# EasyEDA Pro project ProPrj_超级电容V1.1-正式版.epro, board PCB1
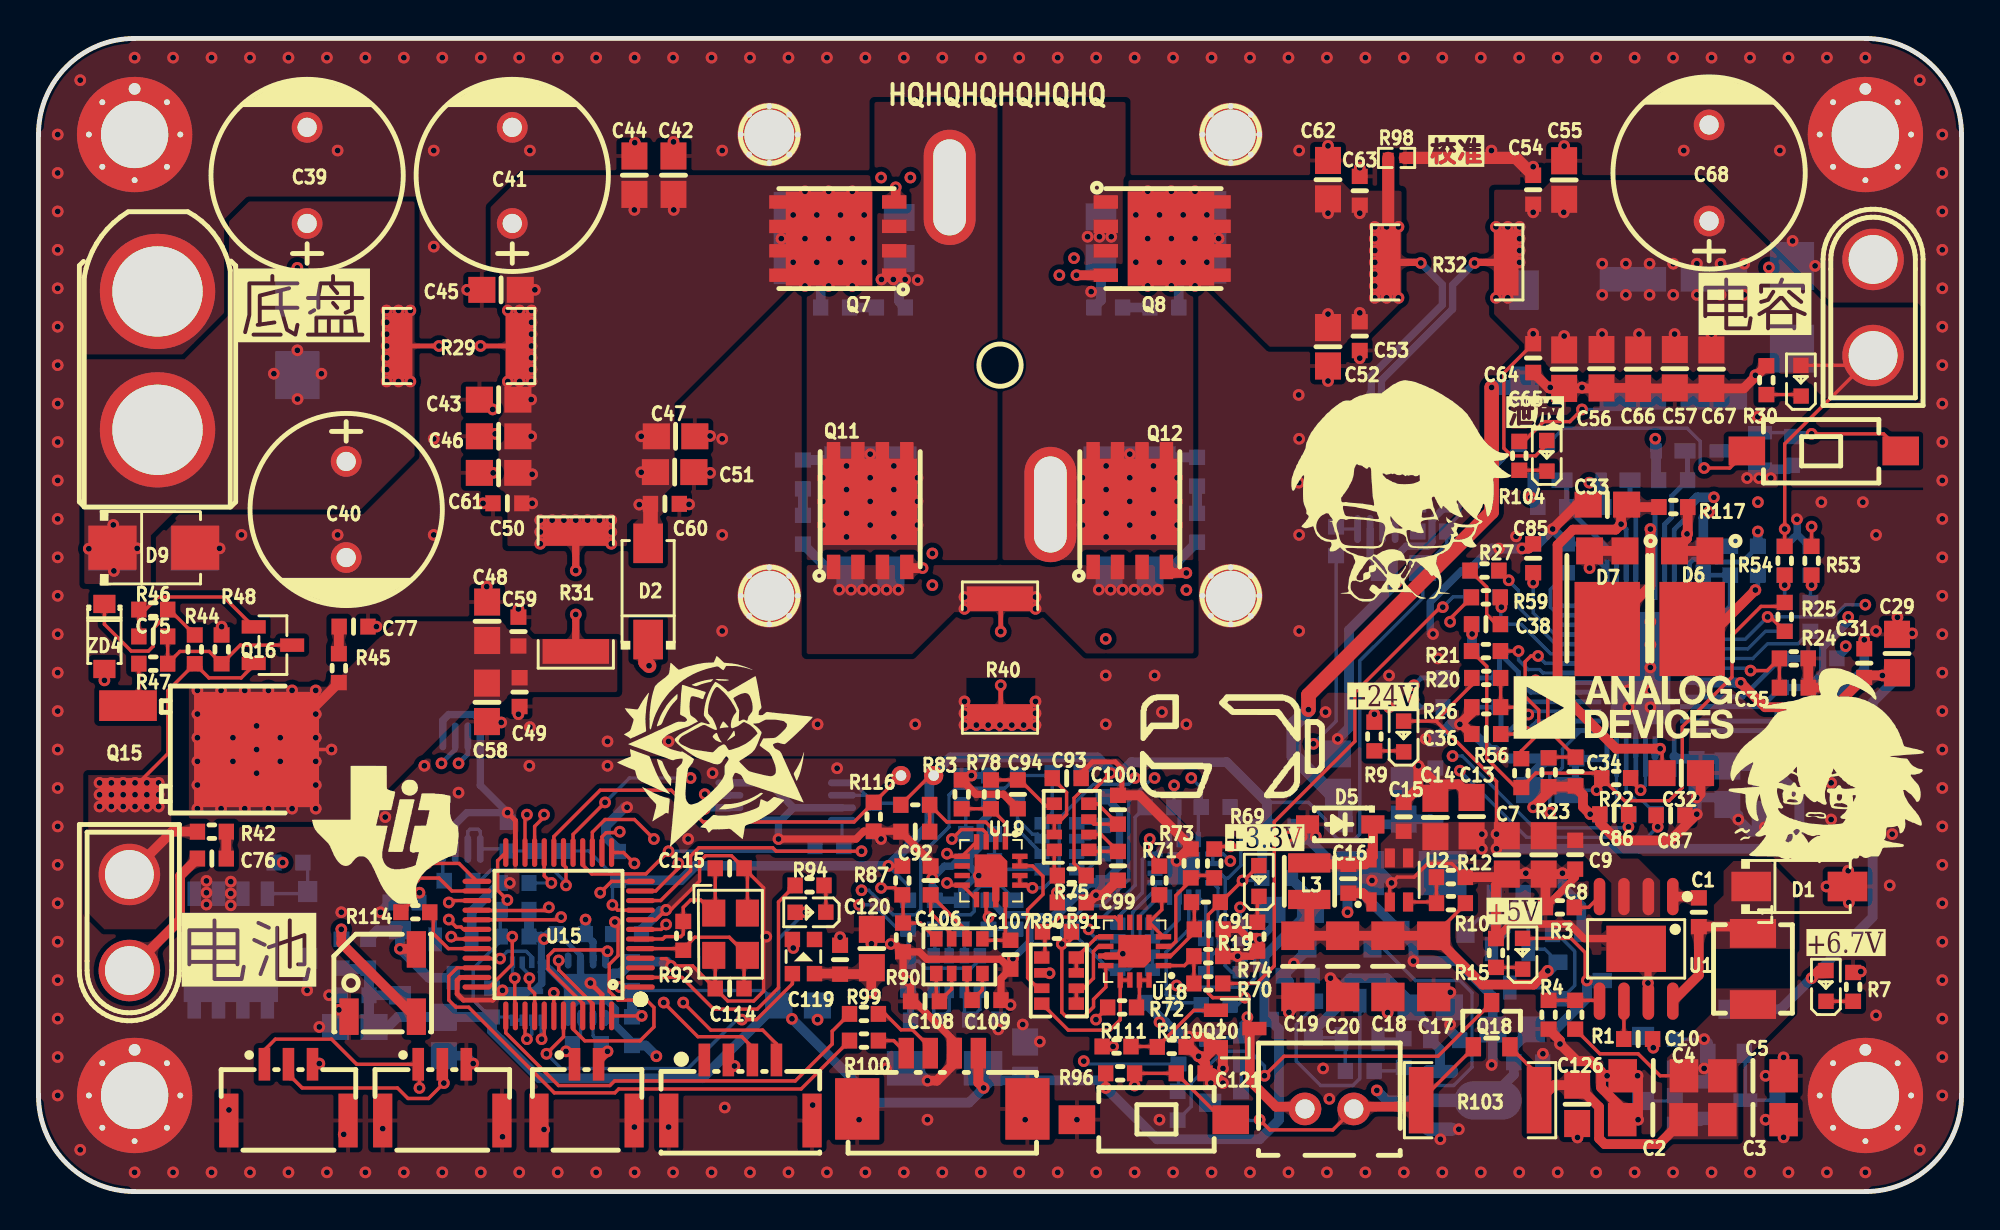
[diagram p8: board, top side]
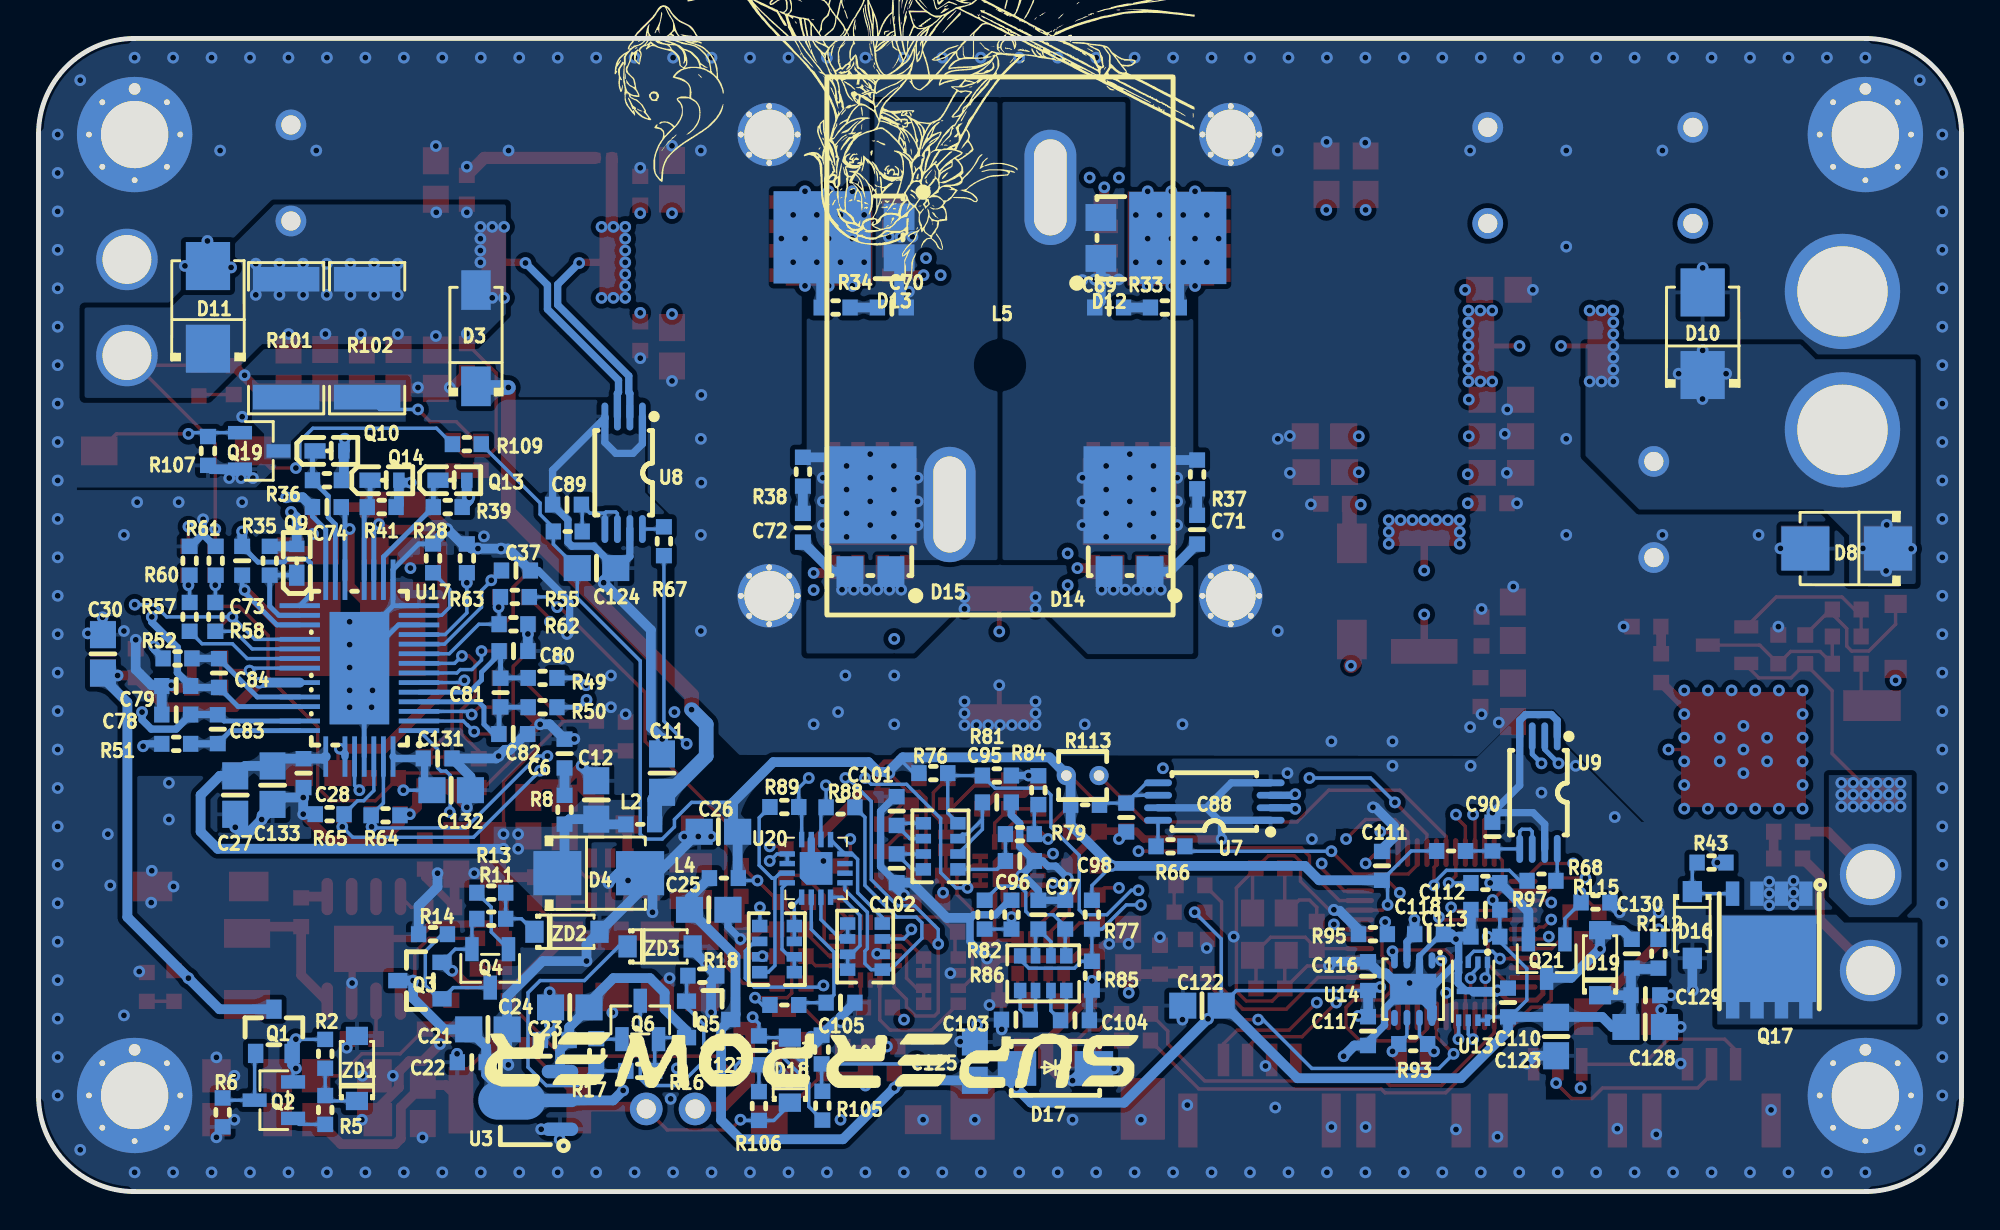
[diagram p9: board, bottom side, seen from below]

Outline 100 x 60 mm; copper layers: Top Layer, 信号, 电源, Bottom Layer. Coordinates in mm from the lower left corner of the outline.
Outline path: 0,55 0,5 arc(1.46,1.46) 5,0 95,0 arc(98.54,1.46) 100,5 100,55 arc(98.54,58.54) 95,60 5,60 arc(1.46,58.54) 0,55
Stack: Top Layer 0.035mm 外层铜厚1oz / Dielectric1 0.2104mm 7628 RC49% 8.6mil / 信号 0.0152mm 内层铜厚 / Dielectric2 1.065mm 1.1mm H/HOZ 含铜 / 电源 0.0152mm 内层铜厚 / Dielectric3 0.2104mm 7628 RC49% 8.6mil / Bottom Layer 0.035mm 外层铜厚1oz

## Design rules (mm)
net CSP: DP4
net CSN: DP4
net CAN-: DP5
net CAN+: DP5
net OSCOUT: DP6
net OSCIN: DP6
template: 自定义配置
spacing copperThickness1oz (default): track to track 0.152, other pairs 0 to 0.3
spacing copperThickness2oz: track to track 0.203, other pairs 0.152 to 0.3
track width copperThickness1oz (default): min 0.127, default 0.254, max 2.54
track width copperThickness2oz: min 0.203, default 0.254, max 2.54
differential pair differentialPair (default): width min 0.127, default 0.254, max 2.54; gap min 0.152, default 0.152
via viaSize (default): diameter min 0.5, default 0.61, max 10; hole min 0.3, default 0.305, max 6.299
net AGND uses 大电流
net CELL uses 大电流
net CAP uses 大电流
net CS+ uses 大电流
net SW2 uses 大电流
net SW1 uses 大电流
net VIN uses 大电流
net CHASSIS uses 大电流
net CSOUT+ uses 大电流
pour e2638 uses 多层直连
pour e18530 uses 多层直连

## Placement (name value [footprint] x y rotation side)
BUZZER1  SMD-5025-0340-12Ω  [BUZ-SMD_3P-L5.0-W5.0-BL]  17.9 10.85 90 top
C1  100nF  [0603电容-简化]  86.34 14.53 270 top
C2  47uF  [1206电容-简化]  83.95 3.74 180 top
C3  47uF  [1206电容-简化]  89.15 3.74 0 top
C4  47uF  [1206电容-简化]  83.97 6.03 180 top
C5  47uF  [1206电容-简化]  89.15 6.03 0 top
C6  100nF  [0603电容-简化]  72.64 22.79 90 bottom
C7  10uF  [0805电容-简化]  76.35 17.52 90 top
C8  10uF  [0805电容-简化]  78.27 17.52 90 top
C9  100nF  [0603电容-简化]  79.91 17.53 90 top
C10  10nF  [0603电容-简化]  83.19 7.94 0 top
C11  10uF  [0805电容-简化]  67.57 21.77 270 bottom
C12  10uF  [0805电容-简化]  70.99 20.38 270 bottom
C13  10uF  [0805电容-简化]  74.52 19.51 270 top
C14  10uF  [0805电容-简化]  72.64 19.46 270 top
C15  100nF  [0603电容-简化]  70.99 19.5 270 top
C16  100nF  [0603电容-简化]  68.11 16.28 90 top
C17  47uF  [1206电容-简化]  72.55 11.72 270 top
C18  47uF  [1206电容-简化]  70.17 11.72 270 top
C19  47uF  [1206电容-简化]  65.49 11.72 270 top
C20  47uF  [1206电容-简化]  67.82 11.72 270 top
C21  10uF  [0805电容-简化]  76.63 8.44 180 bottom
C22  100nF  [0603电容-简化]  77.47 6.73 180 bottom
C23  100nF  [0603电容-简化]  73.15 7.88 0 bottom
C24  10uF  [0805电容-简化]  72.37 9.58 180 bottom
C25  10uF  [0805电容-简化]  65.15 14.66 180 bottom
C26  10uF  [0805电容-简化]  64.64 18.72 180 bottom
C27  10uF  [0805电容-简化]  89.77 20.63 90 bottom
C28  100nF  [0603电容-简化]  86.22 21.77 270 bottom
C29  10uF  [0805电容-简化]  96.65 28 270 top
C30  10uF  [0805电容-简化]  96.65 27.98 270 bottom
C31  100nF  [0603电容-简化]  94.94 27.5 90 top
C32  10uF  [0805电容-简化]  85.43 21.77 0 top
C33  10uF  [0805电容-简化]  81.58 35.74 0 top
C34  10nF  [0603电容-简化]  79.93 21.86 90 top
C35  10nF  [0603电容-简化]  91.28 26.22 180 top
C36  1uF  [0603电容-简化]  75.28 23.81 0 top
C37  220pF  [0603电容-简化]  75.17 32.31 0 bottom
C38  10nF  [0603电容-简化]  75.27 29.52 0 top
C39  220uF  [CAP-TH_BD10.0-P5.00-D0.6-FD]  13.97 52.87 90 top
C40  220uF  [CAP-TH_BD10.0-P5.00-D0.6-FD]  16 35.49 270 top
C41  220uF  [CAP-TH_BD10.0-P5.00-D0.6-FD]  24.64 52.87 90 top
C42  10uF  [0805电容-简化]  33.02 52.88 270 top
C43  10uF  [0805电容-简化]  23.93 41.2 0 top
C44  10uF  [0805电容-简化]  30.99 52.88 270 top
C45  10uF  [0805电容-简化]  24.06 46.92 0 top
C46  10uF  [0805电容-简化]  23.93 39.3 0 top
C47  10uF  [0805电容-简化]  33.13 39.3 0 top
C48  10uF  [0805电容-简化]  23.33 29.67 90 top
C49  100nF  [0603电容-简化]  25.02 25.99 270 top
C50  100nF  [0603电容-简化]  24.38 35.81 180 top
C51  10uF  [0805电容-简化]  33.08 37.44 0 top
C52  10uF  [0805电容-简化]  67.06 43.96 270 top
C53  100nF  [0603电容-简化]  68.71 44.51 270 top
C54  100nF  [0603电容-简化]  77.72 52.13 90 top
C55  10uF  [0805电容-简化]  79.34 52.63 90 top
C56  10uF  [0805电容-简化]  81.28 42.81 270 top
C57  10uF  [0805电容-简化]  85.09 42.81 270 top
C58  10uF  [0805电容-简化]  23.32 25.46 90 top
C59  100nF  [0603电容-简化]  24.96 29.14 270 top
C60  100nF  [0603电容-简化]  32.57 35.78 180 top
C61  10uF  [0805电容-简化]  23.93 37.39 0 top
C62  10uF  [0805电容-简化]  67.06 52.65 270 top
C63  100nF  [0603电容-简化]  68.71 52.07 270 top
C64  100nF  [0603电容-简化]  77.72 43.37 90 top
C65  10uF  [0805电容-简化]  79.34 42.79 90 top
C66  10uF  [0805电容-简化]  83.19 42.79 90 top
C67  10uF  [0805电容-简化]  87 42.79 90 top
C68  220uF  [CAP-TH_BD10.0-P5.00-D0.6-FD]  86.87 53 90 top
C69  4.7nF  [0603电容-简化]  44.32 46 180 bottom
C70  4.7nF  [0603电容-简化]  55.63 46 0 bottom
C71  4.7nF  [0603电容-简化]  39.75 34.44 90 bottom
C72  4.7nF  [0603电容-简化]  60.25 34.54 90 bottom
C73  1uF  [0603电容-简化]  89.41 32.82 270 bottom
C74  1uF  [0603电容-简化]  85 35.62 180 bottom
C75  100nF  [0603电容-简化]  5.97 28.89 180 top
C76  10nF  [0603电容-简化]  9.02 17.33 180 top
C77  10nF  [0603电容-简化]  16.38 29.4 0 top
C78  100nF  [0603电容-简化]  92.84 24.82 180 bottom
C79  100nF  [0603电容-简化]  92.84 26.31 0 bottom
C80  10nF  [0603电容-简化]  75.3 28.12 180 bottom
C81  10nF  [0603电容-简化]  75.97 25.96 90 bottom
C82  10nF  [0603电容-简化]  75.31 23.81 0 bottom
C83  470nF  [0603电容-简化]  90.68 24.06 270 bottom
C84  470nF  [0603电容-简化]  90.61 26.98 270 bottom
C85  47nF  [0603电容-简化]  77.72 32.95 270 top
C86  47nF  [0603电容-简化]  81.94 19.64 0 top
C87  47nF  [0603电容-简化]  84.87 19.58 180 top
C88  100nF  [0603电容-简化]  43.43 19.46 270 bottom
C89  100nF  [0603电容-简化]  72.52 35.74 0 bottom
C90  100nF  [0603电容-简化]  24.4 18.47 90 bottom
C91  100nF  [0603电容-简化]  60.86 13.64 0 top
C92  100nF  [0603电容-简化]  45.59 18.72 180 top
C93  10nF  [0603电容-简化]  53.47 21.51 0 top
C94  10nF  [0603电容-简化]  50.93 20.67 90 top
C95  10nF  [0603电容-简化]  50.16 20.25 180 bottom
C96  10nF  [0603电容-简化]  48.97 17.2 0 bottom
C97  10nF  [0603电容-简化]  48.01 14.41 90 bottom
C98  10nF  [0603电容-简化]  46.61 14.41 270 bottom
C99  10nF  [0603电容-简化]  56.13 16.95 90 top
C100  10nF  [0603电容-简化]  56.13 19.87 270 top
C101  10nF  [0603电容-简化]  55.37 19.8 270 bottom
C102  10nF  [0603电容-简化]  55.37 16.82 90 bottom
C103  10nF  [0603电容-简化]  49.17 8.95 180 bottom
C104  10nF  [0603电容-简化]  46.1 8.91 0 bottom
C105  100nF  [0603电容-简化]  58.29 9.83 180 bottom
C106  10nF  [0603电容-简化]  46.39 16.19 90 top
C107  10nF  [0603电容-简化]  50.55 12.33 90 top
C108  10nF  [0603电容-简化]  46.1 9.9 0 top
C109  10nF  [0603电容-简化]  49.3 9.96 180 top
C110  100nF  [0603电容-简化]  23.58 9.84 270 bottom
C111  100nF  [0603电容-简化]  30.14 16.95 270 bottom
C112  100nF  [0603电容-简化]  24.76 14.66 180 bottom
C113  100nF  [0603电容-简化]  24.76 13.26 180 bottom
C114  20pF  [0603电容-简化]  35.94 10.57 180 top
C115  20pF  [0603电容-简化]  35.94 16.82 0 top
C116  100nF  [0603电容-简化]  30.86 11.21 270 bottom
C117  100nF  [0603电容-简化]  30.86 8.35 90 bottom
C118  100nF  [0603电容-简化]  27.69 13.39 180 bottom
C119  100nF  [0603电容-简化]  41.68 12.07 90 top
C120  10uF  [0805电容-简化]  43.34 12.64 90 top
C121  100nF  [0603电容-简化]  59.91 6.15 0 top
C122  10uF  [0805电容-简化]  39.5 9.67 180 bottom
C123  10uF  [0805电容-简化]  21.08 8.07 90 bottom
C124  10uF  [0805电容-简化]  70.98 32.44 0 bottom
C125  10uF  [0805电容-简化]  51.31 6.79 270 bottom
C126  10uF  [0805电容-简化]  80.01 4.54 270 top
C127  10nF  [0603电容-简化]  62.54 7.35 90 bottom
C128  10uF  [0805电容-简化]  16.45 8.56 180 bottom
C129  100nF  [0603电容-简化]  16.44 10.22 0 bottom
C130  100nF  [0603电容-简化]  17.14 12.38 270 bottom
C131  100nF  [0603电容-简化]  79.24 22.53 180 bottom
C132  10uF  [0805电容-简化]  78.54 20.88 0 bottom
C133  10uF  [0805电容-简化]  87.83 21.14 90 bottom
CN1  XT60UPB-F  [CONN-TH_XT60UPB-F]  6.19 43.24 270 top
CN2  XT30U-M  [conn-th_xt30u-m]  95.4 46 90 top
CN3  XT30U-M  [conn-th_xt30u-m]  4.73 14 270 top
CN4  WAFER-GH1.25-4PWB  [CONN-SMD_4P-P1.25_XUNPU_WAFER-GH1.25-4PWB]  36.5 5.27 0 top
CN5  WAFER-GH1.25-2PLB  [conn-th_2p-p1.25_xunpu_wafer-gh1.25-2plb]  28.5 4.95 0 top
CN6  WAFER-GH1.25-3PLB  [conn-smd_3p-p1.25_xunpu_wafer-gh1.25-3plb]  21 4.95 0 top
CN7  WAFER-GH1.25-3PLB  [conn-smd_3p-p1.25_xunpu_wafer-gh1.25-3plb]  13 4.95 0 top
CN8  532610471  [CONN-SMD_4P-P1.25_53261-0471]  47 5.75 0 top
CN9  B2B-XH-A(LF)(SN)  [CONN-TH_B2B-XH-A-LF-SN]  67.13 4.3 0 top
D1  SS54  [SMA_L4.4-W2.8-LS5.4-R-RD]  91.57 15.87 0 top
D2  SS54  [SMA_L4.4-W2.8-LS5.4-R-RD]  31.7 31.23 90 top
D3  SS54  [SMA_L4.4-W2.8-LS5.4-R-RD]  77.25 44.4 90 bottom
D4  SMBJ33A-E3/52  [SMB_L4.3-W3.6-LS5.3-RD]  70.87 16.57 180 bottom
D5  B5819W SL  [SOD-123_L2.7-W1.6-LS3.7-RD-1]  67.69 19.11 180 top
D6  SBR10E45P5-13  [POWERDI-5_L5.4-W4.0-LS6.5-RD]  85.99 31.3 90 top
D7  SBR10E45P5-13  [POWERDI-5_L5.4-W4.0-LS6.5-RD]  81.58 31.3 90 top
D8  SMBJ33A-E3/52  [SMB_L4.3-W3.6-LS5.3-RD]  5.97 33.46 0 bottom
D9  SMBJ33A-E3/52  [SMB_L4.3-W3.6-LS5.3-RD]  6 33.5 0 top
D10  SMBJ33A-E3/52  [SMB_L4.3-W3.6-LS5.3-RD]  13.46 44.63 90 bottom
D11  SMBJ33A-E3/52  [SMB_L4.3-W3.6-LS5.3-RD]  91.19 46.01 90 bottom
D12  SS10P6-M3/86A  [TO-277A_L6.1-W4.6-P2.13-LS6.5-TR]  42.75 49.62 0 bottom
D13  SS10P6-M3/86A  [TO-277A_L6.1-W4.6-P2.13-LS6.5-TR]  57.25 49.65 180 bottom
D14  SS10P6-M3/86A  [TO-277A_L6.1-W4.6-P2.13-LS6.5-TR]  43.26 34.25 270 bottom
D15  SS10P6-M3/86A  [TO-277A_L6.1-W4.6-P2.13-LS6.5-TR]  56.74 34.25 270 bottom
D16  MMSZ5239B_R1_00001  [SOD-123F_L2.7-W1.6-LS3.8-RD-1]  14 13.87 270 bottom
D17  SMAJ5.0CA/TR13  [SMA_L4.4-W2.6-LS5.0-BI]  47.12 6.41 0 bottom
D18  1N4148W  [SOD-123_L2.8-W1.8-LS3.7-RD]  60.93 6.32 90 bottom
D19  1N4148W  [SOD-123_L2.8-W1.8-LS3.7-RD]  18.8 11.91 90 bottom
L1  22uH  [IND-SMD_L4.5-W4.1_SRP4020TA]  89.15 11.58 270 top
L2  10uH  [0603磁珠-简化]  68.71 19.11 0 bottom
L3  10uH  [IND-SMD_L2.5-W2.0_SWPA252012S]  66.08 16.15 270 top
L4  10uH  [0603磁珠-简化]  64.36 16.31 180 bottom
L5  -  [VER2923-332KL]  50 44 270 bottom
LED1  XL-1608SURC-06  [LED0603-RD_RED]  92.95 10.7 90 top
LED2  XL-1608SURC-06  [LED0603-RD_RED]  70.99 23.68 90 top
LED3  XL-1608SURC-06  [LED0603-RD_RED]  77.18 12.38 90 top
LED4  XL-1608SURC-06  [LED0603-RD_RED]  63.46 16.16 90 top
LED5  XL-1608SURC-06  [LED0603-RD_RED]  91.65 42.19 90 top
LED6  XL-1608SURC-06  [LED0603-RD_RED]  40.14 14.53 180 top
LED7  XL-1608SURC-06  [LED0603-RD_RED]  78.44 38.28 90 top
Q1  AO3401A  [SOT-23_L2.9-W1.3-P1.90-LS2.4-BR]  87.76 8.34 270 bottom
Q2  MMBT5401  [SOT-23-3_L2.9-W1.3-P1.90-LS2.4-BR]  87.76 4.75 180 bottom
Q3  AO3401A  [SOT-23_L2.9-W1.3-P1.90-LS2.4-BR]  80.16 10.98 180 bottom
Q4  MMBT5401  [SOT-23-3_L2.9-W1.3-P1.90-LS2.4-BR]  76.51 11.61 90 bottom
Q5  AO3401A  [SOT-23_L2.9-W1.3-P1.90-LS2.4-BR]  65.15 8.96 0 bottom
Q6  MMBT5401  [SOT-23-3_L2.9-W1.3-P1.90-LS2.4-BR]  68.71 8.93 270 bottom
Q7  CSD18540Q5B  [VSON-CLIP-8_L5.0-W6.0-P1.27-BL]  41.5 49.59 90 top
Q8  CSD18540Q5B  [VSON-CLIP-8_L5.0-W6.0-P1.27-BL]  58.5 49.59 270 top
Q9  CDBVRL140-HF  [LED-SMD_L1.6-W0.8-RD-2]  86.57 32.82 90 bottom
Q10  CDBVRL140-HF  [LED-SMD_L1.6-W0.8-RD-2]  84.87 38.54 180 bottom
Q11  CSD18540Q5B  [VSON-CLIP-8_L5.0-W6.0-P1.27-BL]  43.25 35.5 0 top
Q12  CSD18540Q5B  [VSON-CLIP-8_L5.0-W6.0-P1.27-BL]  56.75 35.5 0 top
Q13  CDBVRL140-HF  [LED-SMD_L1.6-W0.8-RD-2]  78.47 37.01 180 bottom
Q14  CDBVRL140-HF  [LED-SMD_L1.6-W0.8-RD-2]  82.01 37.01 180 bottom
Q15  AGM60P40D  [TO-252-3_L6.6-W6.1-P4.57-LS9.9-BR]  8 23 180 top
Q16  MMBT5401  [SOT-23-3_L2.9-W1.3-P1.90-LS2.4-BR]  12.19 28.43 180 top
Q17  CSD18540Q5B  [VSON-CLIP-8_L5.0-W6.0-P1.27-BL]  10 12.5 0 bottom
Q18  AO3401A  [SOT-23_L2.9-W1.3-P1.90-LS2.4-BR]  75.56 8.68 270 top
Q19  YJL03N06A  [SOT-23-3_L2.9-W1.3-P1.90-LS2.4-BR]  88.52 38.54 0 bottom
Q20  YJL03N06A  [SOT-23-3_L2.9-W1.3-P1.90-LS2.4-BR]  62.23 8.48 180 top
Q21  YJL03N06A  [SOT-23-3_L2.9-W1.3-P1.90-LS2.4-BR]  21.57 12.12 90 bottom
R1  120kΩ  [0603电阻-简化]  79.91 9.2 270 top
R2  100Ω  [0603电阻-简化]  85.09 7.17 90 bottom
R3  33kΩ  [0603电阻-简化]  79.11 14.79 0 top
R4  15kΩ  [0603电阻-简化]  78.53 9.2 90 top
R5  1kΩ  [0603电阻-简化]  85.09 4.25 270 bottom
R6  100kΩ  [0603电阻-简化]  90.42 4.12 270 bottom
R7  2kΩ  [0603电阻-简化]  94.36 10.65 270 top
R8  33kΩ  [0603电阻-简化]  72.64 19.87 270 bottom
R9  10kΩ  [0603电阻-简化]  69.47 23.68 270 top
R10  82kΩ  [0603电阻-简化]  73.45 15.01 0 top
R11  100Ω  [0603电阻-简化]  76.45 14.19 0 bottom
R12  16kΩ  [0603电阻-简化]  73.45 16.36 180 top
R13  1kΩ  [0603电阻-简化]  76.45 15.55 0 bottom
R14  100kΩ  [0603电阻-简化]  79.48 13.39 0 bottom
R15  2kΩ  [0603电阻-简化]  75.79 12.42 270 top
R16  100Ω  [0603电阻-简化]  68.71 6.28 180 bottom
R17  1kΩ  [0603电阻-简化]  70.99 7.21 90 bottom
R18  100kΩ  [0603电阻-简化]  65.48 11.23 180 bottom
R19  1kΩ  [0603电阻-简化]  63.38 13.26 90 top
R20  330kΩ  [0603电阻-简化]  75.28 26.73 180 top
R21  100kΩ  [0603电阻-简化]  75.27 28.12 0 top
R22  100kΩ  [0603电阻-简化]  82.04 21.52 180 top
R23  17.4kΩ  [0603电阻-简化]  78.53 21.82 90 top
R24  17.4kΩ  [0603电阻-简化]  91.28 27.74 180 top
R25  100kΩ  [0603电阻-简化]  90.81 29.9 90 top
R26  33kΩ  [0603电阻-简化]  75.28 25.2 0 top
R27  10kΩ  [0603电阻-简化]  75.19 32.31 0 top
R28  220kΩ  [0603电阻-简化]  79.48 32.95 270 bottom
R29  0.5mΩ  [R2512]  21.87 44 180 top
R30  10kΩ  [0603电阻-简化]  89.85 42.22 270 top
R31  3mΩ  [R2512]  27.94 31.17 90 top
R32  0.5mΩ  [R2512]  73.25 48.35 180 top
R33  1Ω  [0603电阻-简化]  41.43 46 180 bottom
R34  1Ω  [0603电阻-简化]  58.55 46 0 bottom
R35  1Ω  [0603电阻-简化]  87.97 32.82 90 bottom
R36  1Ω  [0603电阻-简化]  85 37.01 0 bottom
R37  1Ω  [0603电阻-简化]  39.75 37.31 90 bottom
R38  1Ω  [0603电阻-简化]  60.25 37.45 90 bottom
R39  1Ω  [0603电阻-简化]  78.72 35.62 180 bottom
R40  0.5mΩ  [R2512]  50 27.78 90 top
R41  1Ω  [0603电阻-简化]  82.15 35.62 0 bottom
R42  10Ω  [0603电阻-简化]  9.02 18.73 180 top
R43  100kΩ  [0603电阻-简化]  13 17.12 0 bottom
R44  100kΩ  [0603电阻-简化]  8.13 28.21 90 top
R45  10Ω  [0603电阻-简化]  15.62 27.23 270 top
R46  1kΩ  [0603电阻-简化]  5.97 30.28 180 top
R47  1kΩ  [0603电阻-简化]  5.97 27.47 180 top
R48  10kΩ  [0603电阻-简化]  9.53 28.21 270 top
R49  10Ω  [0603电阻-简化]  73.79 26.73 180 bottom
R50  10Ω  [0603电阻-简化]  73.79 25.2 180 bottom
R51  10Ω  [0603电阻-简化]  92.84 23.3 0 bottom
R52  10Ω  [0603电阻-简化]  92.77 27.74 0 bottom
R53  330kΩ  [0603电阻-简化]  92.2 32.82 90 top
R54  33kΩ  [0603电阻-简化]  90.81 32.82 90 top
R55  330kΩ  [0603电阻-简化]  75.23 30.94 180 bottom
R56  100kΩ  [0603电阻-简化]  77.11 21.77 270 top
R57  15kΩ  [0603电阻-简化]  92.14 29.9 90 bottom
R58  3MΩ  [0603电阻-简化]  90.8 29.9 90 bottom
R59  220kΩ  [0603电阻-简化]  75.27 30.92 180 top
R60  15kΩ  [0603电阻-简化]  92.14 32.82 270 bottom
R61  100kΩ  [0603电阻-简化]  90.79 32.82 90 bottom
R62  15kΩ  [0603电阻-简化]  75.3 29.52 0 bottom
R63  22kΩ  [0603电阻-简化]  77.72 32.95 270 bottom
R64  22kΩ  [0603电阻-简化]  81.95 19.58 0 bottom
R65  22kΩ  [0603电阻-简化]  84.86 19.64 180 bottom
R66  10Ω  [0603电阻-简化]  41.13 17.96 0 bottom
R67  10Ω  [0603电阻-简化]  67.48 33.84 90 bottom
R68  10Ω  [0603电阻-简化]  21.84 16.17 180 bottom
R69  330kΩ  [0603电阻-简化]  61.14 17.07 90 top
R70  330kΩ  [0603电阻-简化]  60.83 10.83 0 top
R71  10Ω  [0603电阻-简化]  58.29 16.19 270 top
R72  10Ω  [0603电阻-简化]  56.35 9.58 0 top
R73  22kΩ  [0603电阻-简化]  59.92 17.07 270 top
R74  22kΩ  [0603电阻-简化]  60.83 12.25 180 top
R75  22kΩ  [0603电阻-简化]  53.73 16.44 0 top
R76  24kΩ  [0603电阻-简化]  53.47 21.77 0 bottom
R77  24kΩ  [0603电阻-简化]  45.22 14.41 90 bottom
R78  56kΩ  [0603电阻-简化]  49.53 20.67 270 top
R79  56kΩ  [0603电阻-简化]  48.97 18.6 180 bottom
R80  120kΩ  [0603电阻-简化]  53.73 15.04 180 top
R81  56kΩ  [0603电阻-简化]  50.16 21.65 0 bottom
R82  56kΩ  [0603电阻-简化]  50.8 14.41 270 bottom
R83  120kΩ  [0603电阻-简化]  48.01 20.67 270 top
R84  120kΩ  [0603电阻-简化]  48.01 20.88 270 bottom
R85  56kΩ  [0603电阻-简化]  45.22 11.23 90 bottom
R86  120kΩ  [0603电阻-简化]  49.4 14.41 270 bottom
R87  24kΩ  [0603电阻-简化]  44.92 16.19 90 top
R88  47kΩ  [0603电阻-简化]  58.29 20 0 bottom
R89  47kΩ  [0603电阻-简化]  61.21 20.01 180 bottom
R90  56kΩ  [0603电阻-简化]  44.96 13.22 90 top
R91  47kΩ  [0603电阻-简化]  52.96 13.52 0 top
R92  1M  [0603电阻-简化]  33.53 13.31 270 top
R93  120Ω  [0603电阻-简化]  28.51 7.68 180 bottom
R94  1kΩ  [0603电阻-简化]  40.09 15.93 0 top
R95  100kΩ  [0603电阻-简化]  30.61 13.39 0 bottom
R96  10kΩ  [0603电阻-简化]  56.25 6.15 180 top
R97  100kΩ  [0603电阻-简化]  24.76 16.06 0 bottom
R98  0Ω  [R0402]  70.62 53.78 180 top
R99  100Ω  [0603电阻-简化]  42.93 9.24 0 top
R100  100Ω  [0603电阻-简化]  42.93 7.85 0 top
R101  1kΩ  [R2512]  87.12 44.4 90 bottom
R102  1kΩ  [R2512]  82.91 44.4 90 bottom
R103  2Ω  [R2512]  74.97 4.75 180 top
R104  2kΩ  [0603电阻-简化]  77 38.28 270 top
R105  10kΩ  [0603电阻-简化]  59.24 4.47 90 bottom
R106  10Ω  [0603电阻-简化]  62.54 4.45 270 bottom
R107  100kΩ  [0603电阻-简化]  91.19 38.54 270 bottom
R108  10kΩ  [0603电阻-简化]  59.28 7.39 90 bottom
R109  1kΩ  [0603电阻-简化]  77.72 38.89 0 bottom
R110  10kΩ  [0603电阻-简化]  58.93 7.53 180 top
R111  1Ω  [0603电阻-简化]  56.06 7.55 0 top
R112  20Ω  [0603电阻-简化]  15.77 12.38 90 bottom
R113  MF52A103F3950 (A1)  [RES-TH_L2.5-W2.5-P1.70-D0.3]  45.7 21.65 0 bottom
R114  1Ω  [0603电阻-简化]  19.6 14.53 180 top
R115  10kΩ  [0603电阻-简化]  19.04 15.04 0 bottom
R116  2kΩ  [0603电阻-简化]  43.43 19.5 90 top
R117  1Ω  [0603电阻-简化]  85.01 35.62 0 top
RN1  11kΩ  [RES-ARRAY-SMD_0603-8P-L3.2-W1.6-BL]  53.72 18.98 270 top
RN2  11kΩ  [RES-ARRAY-SMD_0603-8P-L3.2-W1.6-BL]  53.09 17.96 90 bottom
RN3  11kΩ  [RES-ARRAY-SMD_0603-8P-L3.2-W1.6-BL]  47.75 11.36 0 bottom
RN4  11kΩ  [RES-ARRAY-SMD_0603-8P-L3.2-W1.6-BL]  57.02 12.75 270 bottom
RN5  11kΩ  [RES-ARRAY-SMD_0603-8P-L3.2-W1.6-BL]  61.59 12.61 90 bottom
RN6  11kΩ  [RES-ARRAY-SMD_0603-8P-L3.2-W1.6-BL]  47.89 12.25 180 top
RN7  11kΩ  [RES-ARRAY-SMD_0603-8P-L3.2-W1.6-BL]  53.07 10.98 90 top
SW1  TS-1101-C-W  [SW-SMD_L6.0-W3.3-LS8.0]  58 3.74 180 top
SW2  TS-1101-C-W  [SW-SMD_L6.0-W3.3-LS8.0]  92.84 38.54 0 top
TP1  -  [M3泄压焊盘]  5 5 0 top
TP2  -  [M3泄压焊盘]  5 55 0 top
TP3  -  [M3泄压焊盘]  95 55 0 top
TP4  -  [M3泄压焊盘]  95 5 0 top
TP5  -  [M2.5泄压焊盘]  38 31 0 top
TP6  -  [M2.5泄压焊盘]  62 31 0 top
TP7  -  [M2.5泄压焊盘]  38 55 0 top
TP8  -  [M2.5泄压焊盘]  62 55 0 top
U1  LMR14050SDDAR  [SOIC-8_L4.9-W3.9-P1.27-LS6.0-BL-EP]  83.08 12.63 180 top
U2  LGS5145  [SOT-23-6_L2.9-W1.7-P0.95-LS2.8-BL]  70.27 16.21 0 top
U3  SSP7903P33PR  [SOT-89-3_L4.5-W2.5-P1.50-LS4.1-BR]  74.13 4.74 180 bottom
U4  BLM18PG121SN1D  [0603磁珠-简化]  45.57 20.12 0 bottom
U5  BLM18PG121SN1D  [0603磁珠-简化]  72.48 34.35 0 bottom
U6  BLM18PG121SN1D  [0603磁珠-简化]  26.54 17.72 0 bottom
U7  INA240A2PWR  [TSSOP-8_L4.4-W3.0-P0.65-LS6.4-BL]  38.86 20.29 90 bottom
U8  INA240A2PWR  [TSSOP-8_L4.4-W3.0-P0.65-LS6.4-BL]  69.57 37.4 0 bottom
U9  INA240A2PWR  [TSSOP-8_L4.4-W3.0-P0.65-LS6.4-BL]  22 20.76 0 bottom
U10  BLM18PG121SN1D  [0603磁珠-简化]  60.71 15.06 0 top
U11  BLM18PG121SN1D  [0603磁珠-简化]  45.59 20.12 180 top
U12  BLM18PG121SN1D  [0603磁珠-简化]  61.21 9.71 0 bottom
U13  ZD25WQ16CEIGR  [USON-8_L3.0-W2.0-P0.50-BL-EP]  25.4 10.42 0 bottom
U14  SIT1050TK  [TDFN-8_L3.0-W3.0-P0.65-BL-EP]  28.51 10.53 0 bottom
U15  STM32F103C8T6  [LQFP-48_L7.0-W7.0-P0.50-LS9.0-BL]  27.05 13.39 90 top
U16  XL-0807RGBC-WS2812B  [LED-SMD_4P-L2.0-W1.8_CY-0807]  39.78 12.23 270 top
U17  LT8708EUHG#TRPBF  [QFN-40_LT8708_Test]  83.31 27.23 0 bottom
U18  TLV9004IRTER  [WQFN-16_L3.0-W3.0-P0.50-TL-EP1.7]  57 12.51 180 top
U19  TLV9004IRTER  [WQFN-16_L3.0-W3.0-P0.50-TL-EP1.7]  49.53 16.69 270 top
U20  TLV9004IRTER  [WQFN-16_L3.0-W3.0-P0.50-TL-EP1.7]  59.56 16.82 90 bottom
X1  8MHz  [CRYSTAL-SMD_4P-L3.2-W2.5-BL-1]  35.99 13.39 270 top
ZD1  MMSZ5246B  [SOD-123_L2.8-W1.8-LS3.7-RD]  83.44 6.41 90 bottom
ZD2  MMSZ5232B  [SOD-123_L2.8-W1.8-LS3.7-RD]  72.52 13.52 180 bottom
ZD3  MMSZ5228B  [SOD-123_L2.8-W1.8-LS3.7-RD]  67.67 12.76 180 bottom
ZD4  MMSZ5256B  [SOD-123_L2.8-W1.8-LS3.7-RD]  3.43 28.88 270 top

## Footprints (pads in the part's own frame, mm; a bottom-side part is the same pattern mirrored in y, then rotated)
0603电容-简化
  rect 0.8x0.83 smd: 1(-0.75,0) 2(0.75,0)
0603电阻-简化
  rect 0.8x0.83 smd: 1(-0.75,0) 2(0.75,0)
0603磁珠-简化
  rect 0.8x0.83 smd: 1(-0.75,0) 2(0.75,0)
0805电容-简化
  rect 1.41x1.35 smd: 1(-1,0) 2(1,0)
1206电容-简化
  rect 1.485x1.728 smd: 1(1.593,0) 2(-1.593,0)
BUZ-SMD_3P-L5.0-W5.0-BL
  rect 1.9x1 smd: 1(-1.75,-1.75) 2(1.75,-1.75) 3(-1.75,1.75)
CAP-TH_BD10.0-P5.00-D0.6-FD
  round 1.6 hole 1: 1(-2.5,0) 2(2.5,0)
conn-smd_3p-p1.25_xunpu_wafer-gh1.25-3plb
  rect 0.6x1.7 smd: 1(-1.25,1.675) 2(0.001,1.675) 3(1.25,1.675)
  rect 1x2.8 smd: 4(3.1,-1.252) 5(-3.1,-1.252)
CONN-SMD_4P-P1.25_53261-0471
  rect 0.8x1.6 smd: 1(-1.875,1.45) 2(-0.625,1.45) 3(0.625,1.45) 4(1.875,1.45)
  rect 2.3x3.2 smd: 5(4.425,-1.45) 6(-4.425,-1.45)
CONN-SMD_4P-P1.25_XUNPU_WAFER-GH1.25-4PWB
  rect 0.6x1.7 smd: 1(-1.875,1.575) 2(-0.625,1.575) 3(0.625,1.575) 4(1.875,1.575)
  rect 1x2.8 smd: 5(3.725,-1.575) 6(-3.725,-1.575)
conn-th_2p-p1.25_xunpu_wafer-gh1.25-2plb
  rect 0.6x1.7 smd: 1(-0.625,1.675) 2(0.625,1.675)
  rect 1x2.8 smd: 3(2.475,-1.252) 4(-2.475,-1.252)
CONN-TH_B2B-XH-A-LF-SN
  round 1.7 hole 1: 1(1.27,0) 2(-1.27,0)
conn-th_xt30u-m
  round 3.2 hole 2.54x2.2: 1(-2.5,0) 2(2.5,0)
CONN-TH_XT60UPB-F
  round 6 hole 4.7: 1(3.6,0) 2(-3.6,0)
CRYSTAL-SMD_4P-L3.2-W2.5-BL-1
  rect 1.4x1.2 smd: 1(-1.1,-0.875) 2(1.1,-0.875) 3(1.1,0.875) 4(-1.1,0.875)
IND-SMD_L2.5-W2.0_SWPA252012S
  rect 1x2.2 smd: 1(-0.951,0) 2(0.951,0)
IND-SMD_L4.5-W4.1_SRP4020TA
  rect 1.5x2.4 smd: 1(-1.85,0) 2(1.85,0)
LED0603-RD_RED
  rect 0.8x0.8 smd: 1(-0.799,-0.004) 2(0.799,0.004)
LED-SMD_4P-L2.0-W1.8_CY-0807
  rect 0.8x0.8 smd: 1(0.889,0.575) 2(-0.889,0.575) 3(-0.889,-0.575) 4(0.889,-0.575)
LED-SMD_L1.6-W0.8-RD-2
  rect 0.6x0.8 smd: 1(0.75,0)
  rect 1.1x0.8 smd: 2(-0.75,0)
LQFP-48_L7.0-W7.0-P0.50-LS9.0-BL
  oval 0.27x1.5 smd: 1(-2.75,-4.25) 2(-2.25,-4.25) 3(-1.75,-4.25) 4(-1.25,-4.25) 5(-0.75,-4.25) 6(-0.25,-4.25) 7(0.25,-4.25) 8(0.75,-4.25) 9(1.25,-4.25) 10(1.75,-4.25) 11(2.25,-4.25) 12(2.75,-4.25) 25(2.75,4.25) 26(2.25,4.25) 27(1.75,4.25) 28(1.25,4.25) 29(0.75,4.25) 30(0.25,4.25) 31(-0.25,4.25) 32(-0.75,4.25) 33(-1.25,4.25) 34(-1.75,4.25) 35(-2.25,4.25) 36(-2.75,4.25)
  oval 1.5x0.27 smd: 13(4.25,-2.75) 14(4.25,-2.25) 15(4.25,-1.75) 16(4.25,-1.25) 17(4.25,-0.75) 18(4.25,-0.25) 19(4.25,0.25) 20(4.25,0.75) 21(4.25,1.25) 22(4.25,1.75) 23(4.25,2.25) 24(4.25,2.75) 37(-4.25,2.75) 38(-4.25,2.25) 39(-4.25,1.75) 40(-4.25,1.25) 41(-4.25,0.75) 42(-4.25,0.25) 43(-4.25,-0.25) 44(-4.25,-0.75) 45(-4.25,-1.25) 46(-4.25,-1.75) 47(-4.25,-2.25) 48(-4.25,-2.75)
M2.5泄压焊盘
  round 0.305 hole 0.5x0.305: 1(-1.475,0) 1(-1.043,1.043) 1(-1.043,-1.043) 1(0,1.475) 1(0,-1.475) 1(1.043,1.043) 1(1.043,-1.043) 1(1.475,0)
  round 3.3 hole 2.6: 1(0,0)
M3泄压焊盘
  round 0.61 hole 0.305: 1(-2.375,0) 1(-1.679,1.679) 1(-1.679,-1.679) 1(0,-2.375) 1(1.679,1.679) 1(1.679,-1.679) 1(2.375,0)
  round 0.61 hole 0.914x0.305: 1(0,2.375)
  round 6 hole 3.5: 1(0,0)
POWERDI-5_L5.4-W4.0-LS6.5-RD
  rect 1.4x1.4 smd: 1(2.032,-0.92) 2(2.032,0.92)
  rect 4.9x3.4 smd: 3(-2.032,0)
QFN-40_LT8708_Test
  rect 2.1x0.25 smd: 1(-3.1,3.25) 2(-3.1,2.75) 3(-3.1,2.25) 4(-3.1,1.75) 5(-3.1,1.25) 6(-3.1,0.75) 7(-3.1,0.25) 8(-3.1,-0.25) 9(-3.1,-0.75) 10(-3.1,-1.25) 11(-3.1,-1.75) 12(-3.1,-2.25) 13(-3.1,-2.75) 14(-3.1,-3.25) 22(3.1,-3.25) 23(3.1,-2.75) 24(3.1,-2.25) 25(3.1,-1.5) 26(3.1,-1) 27(3.1,-0.5) 28(3.1,0) 29(3.1,0.75) 30(3.1,1.5) 31(3.1,2) 32(3.1,2.75) 33(3.1,3.25)
  rect 0.25x2.1 smd: 15(-1.75,-4.6) 16(-1.25,-4.6) 17(-0.75,-4.6) 18(-0.25,-4.6) 19(0.75,-4.6) 20(1.25,-4.6) 21(1.75,-4.6) 34(1.75,4.6) 35(0.75,4.6) 36(0.25,4.6) 37(-0.25,4.6) 38(-0.75,4.6) 39(-1.25,4.6) 40(-1.75,4.6)
  rect 3.1x5.85 smd: 41(0,0)
R0402
  rect 0.566x0.54 smd: 1(-0.433,0) 2(0.433,0)
R2512
  rect 1.282x3.456 smd: 1(-3.067,0) 2(3.067,0)
RES-ARRAY-SMD_0603-8P-L3.2-W1.6-BL
  rect 0.65x0.8 smd: 1(-1.2,-0.9) 4(1.2,-0.9) 5(1.2,0.9) 8(-1.2,0.9)
  rect 0.5x0.8 smd: 2(-0.4,-0.9) 3(0.4,-0.9) 6(0.4,0.9) 7(-0.4,0.9)
RES-TH_L2.5-W2.5-P1.70-D0.3
  round 1 hole 0.55: 1(-0.85,0) 2(0.85,0)
SMA_L4.4-W2.6-LS5.0-BI
  rect 2x1.8 smd: 1(-2,0) 2(2,0)
SMA_L4.4-W2.8-LS5.4-R-RD
  rect 2.062x1.539 smd: 1(2.503,0) 2(-2.503,0)
SMB_L4.3-W3.6-LS5.3-RD
  rect 2.5x2.3 smd: 1(-2.15,0) 2(2.15,0)
SOD-123_L2.7-W1.6-LS3.7-RD-1
  rect 1.2x0.95 smd: 1(-1.7,0) 2(1.7,0)
SOD-123_L2.8-W1.8-LS3.7-RD
  rect 0.95x1.15 smd: 1(-1.692,0) 2(1.692,0)
SOD-123F_L2.7-W1.6-LS3.8-RD-1
  rect 1.1x1 smd: 1(-1.735,0) 2(1.735,0)
SOIC-8_L4.9-W3.9-P1.27-LS6.0-BL-EP
  oval 0.602x1.941 smd: 1(-1.905,-2.72) 2(-0.635,-2.72) 3(0.635,-2.72) 4(1.905,-2.72) 5(1.905,2.72) 6(0.635,2.72) 7(-0.635,2.72) 8(-1.905,2.72)
  rect 3.098x2.41 smd: 9(0,0)
SOT-23-3_L2.9-W1.3-P1.90-LS2.4-BR
  rect 1.25x0.7 smd: 1(1,-0.95) 2(1,0.95) 3(-1,0)
SOT-23-6_L2.9-W1.7-P0.95-LS2.8-BL
  rect 0.532x0.99 smd: 1(-0.95,-1.145) 2(0,-1.145) 3(0.95,-1.145) 4(0.95,1.145) 5(0,1.145) 6(-0.95,1.145)
SOT-23_L2.9-W1.3-P1.90-LS2.4-BR
  rect 1x0.8 smd: 1(1.15,-0.95) 2(1.15,0.95) 3(-1.15,0)
SOT-89-3_L4.5-W2.5-P1.50-LS4.1-BR
  oval 1.9x0.7 smd: 1(1.25,-1.501) 3(1.25,1.501)
  oval 3.5x2 smd: 2(-1.25,0)
  oval 2.1x0.7 smd: 2(1.151,0)
SW-SMD_L6.0-W3.3-LS8.0
  rect 1.9x1.5 smd: 1(-4,0) 2(4,0)
TDFN-8_L3.0-W3.0-P0.65-BL-EP
  oval 0.35x0.84 smd: 1(-0.975,-1.495) 2(-0.325,-1.495) 3(0.325,-1.495) 4(0.975,-1.495) 5(0.975,1.495) 6(0.325,1.495) 7(-0.325,1.495) 8(-0.975,1.495)
  rect 2.4x1.6 smd: 9(0,0)
TO-252-3_L6.6-W6.1-P4.57-LS9.9-BR
  rect 3x1.6 smd: 1(3.342,-2.285) 2(3.342,2.285)
  rect 6.5x6 smd: 3(-3.342,0)
TO-277A_L6.1-W4.6-P2.13-LS6.5-TR
  rect 1.6x1.4 smd: 1(2,1.065) 2(2,-1.065)
  rect 5.05x4.8 smd: 3(-2,0)
TSSOP-8_L4.4-W3.0-P0.65-LS6.4-BL
  oval 0.353x1.454 smd: 1(-0.975,-2.927) 2(-0.325,-2.927) 3(0.325,-2.927) 4(0.975,-2.927) 5(0.975,2.927) 6(0.325,2.927) 7(-0.325,2.927) 8(-0.975,2.927)
USON-8_L3.0-W2.0-P0.50-BL-EP
  rect 0.28x0.6 smd: 1(-0.75,-1.508) 2(-0.25,-1.508) 3(0.25,-1.508) 4(0.75,-1.508) 5(0.75,1.508) 6(0.25,1.508) 7(-0.25,1.508) 8(-0.75,1.508)
  rect 1.7x0.3 smd: 9(0,0)
VER2923-332KL
  oval 6x2.7 hole 5x1.7: 1(8.25,-2.62) 2(-8.25,2.62)
VSON-CLIP-8_L5.0-W6.0-P1.27-BL
  rect 0.7x1.27 smd: 1(-1.904,-3) 2(-0.636,-3) 3(0.636,-3) 4(1.906,-3)
  rect 0.7x1 smd: 5(1.904,3) 6(0.634,3) 7(-0.636,3) 8(-1.906,3)
  rect 4.9x4.5 smd: 8(-0.001,0.39)
WQFN-16_L3.0-W3.0-P0.50-TL-EP1.7
  rect 0.8x0.28 smd: 1(-1.5,0.75) 2(-1.5,0.25) 3(-1.5,-0.25) 4(-1.5,-0.75) 9(1.5,-0.75) 10(1.5,-0.25) 11(1.5,0.25) 12(1.5,0.75)
  rect 0.28x0.8 smd: 5(-0.75,-1.5) 6(-0.25,-1.5) 7(0.25,-1.5) 8(0.75,-1.5) 13(0.75,1.5) 14(0.25,1.5) 15(-0.25,1.5) 16(-0.75,1.5)
  custom 1.7x1.7 smd: 17(0,0)

## Nets
As in the schematic.

Pads without a net: CN4 1; U14 5; U15 3 4; U16 2; U18 6 7; U19 6 7; U20 6 7

## Via types
v1: diameter 0.61, hole 0.305, Top Layer to Bottom Layer, 762 vias
v2: diameter 0.61, hole 0.304, Top Layer to Bottom Layer, 28 vias

## Routing (per net, layer and track width the routed paths; a pad name or vN(x,y) marks a point on that pad's centre or on a via; arc(x,y) is an arc through that point)
3V3: length 15
  Bottom Layer w0.178: R16.2 67.96,7.73 Q6.2 67.68,8.01 66.3,8.01
  Bottom Layer w0.508: U3.3 72.88,7.4 C23.1 72.4,8.55 C24.2 71.37,9.84 70.1,11.1 68.2,11.1 67.44,10.34 67.44,9.49 66.3,8.35 66.3,8.01
+5V: length 79
  Top Layer w0.178: v1(80.52,10.98) 80.43,11.07 80.43,12.44 79.69,13.17 LED3.2
  Top Layer w0.508: v1(43.31,10.34) 43.31,11.62 ; 43.31,11.62 43.01,11.32 C119.1 41.66,11.34 U16.1 ; 43.31,11.62 C120.1
  信号 w0.508: 43.31,7.8 45.59,7.8 48.84,4.55 63.56,4.55 64.66,5.64 69.22,5.64 v1(69.6,5.26) ; 43.31,7.8 30.61,7.8 27.76,10.65 27.76,13.47 v1(28.45,14.15) ; 43.31,7.8 v1(43.31,10.34)
  Bottom Layer w0.381: C118.1 28.84,12.99 U14.3
  Bottom Layer w0.508: v1(69.6,5.26) 70.12,4.74 U3.2 76.72,6.08 C22.2 76.72,7.53 C21.1 78.9,8.44 80.52,10.06 v1(80.52,10.98) Q3.3 ; C118.1 28.45,13.4 v1(28.45,14.15)
+6.7V: length 36.1
  Top Layer w0.508: v1(92.2,11.1) 92.59,11.5 LED1.2 ; v1(88.52,26.47) 89.79,25.2 93.4,25.2 C31.1 95.05,26.85 v1(95.88,26.85) 96.5,26.85 C29.2
  Bottom Layer w0.508: v1(88.52,26.47) 88.28,26.47 88.26,26.48 U17.29 ; v1(95.88,26.85) 96.52,26.85 C30.2 96.65,26.73 95.38,25.46 95.38,14.28 v1(92.2,11.1) 90.59,9.49 Q1.3
AGND: length 438.1
  Top Layer w0.178: 36.87,16.65 37.71,15.8 37.71,10.43 37.19,9.91 35.85,9.91 C114.2 ; 36.87,16.65 C115.2 36.03,17.48 34.69,17.48 34.38,17.16 34.38,16.16 32.66,14.45 32.41,14.45 32.11,14.14 U15.8 ; 36.87,16.65 X1.4 ; C114.2 34.02,11.74 33.02,11.74 32.64,12.12 32.38,12.12 ; C114.2 35.19,12.22 X1.2 ; U2.2 70.27,15.97 v1(70.36,16.06) 70.66,16.36 71.54,16.36 72.25,17.07 73.48,17.07 R12.1
  Top Layer w0.254: 29.3,9.14 29.3,10.25 v1(28.7,10.85) ; v1(50.04,26.34) 50.04,24.76 R40.1 ; v1(24.13,10.47) 23.62,9.96 22.1,9.96 21.77,10.29 21.77,10.99 21.93,11.14 22.8,11.14 ; U15.23 24.8,19.31 v1(24.4,19.72) ; C93.2 54.22,21.76 54.81,22.36 56,22.36 56.34,22.02 56.34,20.82 C100.1
  Top Layer w0.381: U19.17 49.78,16.44 U19.11 ; R90.1 45.81,12.47 46.19,12.09 50.03,12.09 C107.1 50.05,11.08 C109.1 ; R90.1 44.96,11.23 v1(45.22,10.96) 45.35,10.83 C108.1 45.55,9.9 47.62,7.83 CN8.3 ; R90.1 44.55,12.88 v1(44.32,12.88) ; C9.1 79.91,16.34 R3.1 ; U1.9 83.69,12.02 v1(83.69,10.85) ; U18.11 56.39,12.26 v1(56.39,12.38) 56.87,12.38 U18.17 ; R83.1 48.75,20.67 50.17,20.67 C94.1 ; v1(46.48,16.31) 46.48,16.85 C106.2 46.39,17.17 C92.2 44.82,18.75 R116.1 42.92,18.75 42.52,18.34 v1(38.48,18.34) ; R15.1 76.54,13.92 79.61,13.92 80.36,13.17 82.54,13.17 82.58,13.13 ; 63.5,12.64 v1(63.5,13.14) 63.37,13.27 62.82,13.27 62.45,13.64 C91.2 61.61,12.27 R74.1 v1(62.36,12.25) 63.11,12.25 R19.1 63.5,12.64
  Top Layer w0.508: C19.1 65.49,9.79 v1(65.02,9.33) ; C2.1 82.35,4.32 81.25,5.42 81.25,6.25 80.72,6.79 80.01,6.79 v1(79.12,7.68) 79.12,7.85 R4.1 ; R12.1 76.2,16.36 ; 76.2,16.36 75.79,15.95 R15.1 ; 76.2,16.36 C7.1 C8.1 ; 79.89,21.07 R23.1 78.53,20.8 v1(77.72,20) ; 79.89,21.07 C34.1 ; 79.89,21.07 80.31,20.64 80.31,20.01 v1(80.69,19.64) C86.1 81.19,19.2 82.12,18.27 84.86,18.27 86.17,19.58 ; v1(78.74,34.47) 80.01,35.74 C33.1 ; R116.1 43.81,18.37 v1(43.81,18.34) ; v1(60.32,7.04) 59.84,7.53 R110.1 ; v1(60.32,7.04) 60.66,6.7 C121.2 61.09,6.15 v1(61.59,5.64) ; v1(60.32,7.04) 60.74,7.04 Q20.2 ; C18.1 70.17,9.32 v1(70.16,9.31) ; C64.1 78.55,41.79 78.66,41.79 ; v1(73.42,10.37) 73.18,10.12 C17.1 ; C87.1 86.17,19.58 ; 86.17,19.58 v1(86.23,19.64) ; v1(46.23,5.77) 46.72,5.77 47.62,6.68 CN8.3 ; C85.1 77.48,33.46 v1(77.15,33.46) ; C8.1 78.36,16.43 R3.1 ; C8.1 79.65,16.52 C9.1 ; R30.1 88.67,41.79 C67.1 85.11,41.79 ; v1(59.82,8.06) 60.71,8.06 Q20.2 ; C20.1 67.82,10.47 v1(67.18,11.1) ; R24.1 C35.1 92.96,26.22 v1(93.09,26.34) ; v1(78.61,41.84) 78.66,41.79 ; 78.66,41.79 C65.1 80.26,41.79 ; R26.1 74.53,24.93 v1(73.91,24.31) 74.03,24.31 C36.1 ; 72.64,21.27 v1(71.75,22.15) 71.75,21.01 C15.1 ; 72.64,21.27 72.72,21.19 73.84,21.19 C13.1 ; 72.64,21.27 C14.1 ; 80.26,41.79 81.26,41.79 C56.2 83.16,41.81 C66.1 85.11,41.79 ; 80.26,41.79 v1(80.26,41.84) ; Q20.2 61.59,7.17 v1(61.59,6.41) ; 85.11,41.79 C57.2 ; BUZZER1.3 15.8,9.45 v1(15.62,9.45) ; C99.1 55.36,15.42 v1(54.99,15.42) 54.61,15.04 R80.1 ; v1(83.15,6.03) 83.18,6 v1(83.18,3.74) ; C100.1 57.25,20.62 59.92,17.95 59.92,17.94 v1(59.18,17.2) ; v1(74.55,29.01) 74.55,29.49 C38.1 ; C32.2 86.43,20.7 v1(86.23,20.5)
  Top Layer w0.635: C54.2 76.82,53.78 R98.1
  信号 w0.254: v1(50.04,26.34) 50.04,26.47 51.05,27.49 55.75,27.49 57.48,25.76 71.32,25.76 v1(71.5,25.58)
  Bottom Layer w0.254: R50.2 71.88,25.2 v1(71.5,25.58) ; U17.12 81.28,29.48 83.31,27.45 ; C118.2 27.06,13.39 28.19,12.26 U14.2 ; U17.14 81.56,30.48 ; 81.56,30.48 83.31,28.73 83.31,27.45 ; 81.56,30.48 U17.15 81.56,32.36 80.23,33.7 R28.1 ; 83.31,27.45 U17.41 83.06,26.98 U17.37
  Bottom Layer w0.381: 48.83,16.5 48.22,17.12 C96.1 ; 48.83,16.5 v1(48.9,16.44) 48.9,16.57 48.83,16.5 ; 48.83,16.5 48.01,15.68 C97.2 C98.1 46.61,15.78 46.48,15.9 v1(46.48,16.31) 47.1,16.93 47.51,16.93 47.78,17.2 C96.1 ; C124.1 71.12,33.58 72.26,33.58 72.47,33.79 72.47,34.94 C89.2 73.27,37.53 70.55,40.25 ; v1(26.29,13.14) 26.15,13 U13.4 ; U8.7 69.25,33.04 v1(70.61,31.68) ; 70.55,40.25 U8.4 ; 70.55,40.25 70.55,38.98 69.98,38.41 69.09,38.41 68.6,38.9 U8.1 ; C95.2 49.41,19.6 48.97,19.16 48.97,17.96 C96.1 ; v1(45.22,10.96) R85.1 45.35,10.35 C104.1 ; v1(91.44,34.98) 91.44,34.75 91.45,34.74 91.45,34.2 ; C25.2 64.15,13.78 v1(63.5,13.14) ; 38.62,19.32 39.27,19.97 ; 38.62,19.32 U7.1 ; 38.62,19.32 38.48,19.18 v1(38.48,18.34) ; 39.27,19.97 37.97,21.27 U7.4 ; 39.27,19.97 U7.7 ; 91.45,34.2 90.82,33.57 ; 91.45,34.2 92.09,33.57 ; C117.1 30.86,7.8 30.01,8.65 30.01,9.5 28.97,10.53 ; R86.1 49.49,15.16 50.24,14.4 51.36,14.4 51.56,14.19 51.56,13.01 v1(50.67,12.12) ; C102.1 56.21,16.91 56.21,19.79 55.45,20.55 C101.1 ; U13.4 26.15,11.4 26.17,11.37 26.17,10.84 25.8,10.46 25.43,10.46 U13.9 ; U13.4 26.23,11.93 27.63,10.53 28.19,10.53 U14.2 ; R84.1 48.02,21.65 v1(48.51,21.65) R81.1 ; v1(72.52,29.01) 72.38,29.01 72.38,30.68 74.01,32.31 C37.1 ; U9.1 21.03,24.52 21.33,24.82 22.67,24.82 22.97,24.52 U9.4 22.97,21.14 v1(24.4,19.72) 22.28,19.72 21.67,19.11 U9.7 ; U20.11 59.81,17.07 U20.17
  Bottom Layer w0.508: v1(32.64,14.66) 32.59,14.61 32.34,14.61 31.36,13.62 R95.2 ; v1(13.97,10.47) 14,10.5 D16.2 ; v1(79.25,16.57) 79.25,15.85 80.23,14.86 R14.2 ; U14.9 29.11,10.53 29.93,11.35 30.26,11.35 C116.1 32.68,11.96 v1(32.89,11.74) ; U14.9 28.19,10.53 ; U14.9 27.54,9.56 U14.8 ; v1(60.32,7.04) 60.26,7.04 59.28,8.03 R108.2 58.6,8.82 v1(58.29,8.82) 58.29,9.08 C105.2 ; v1(65.02,9.33) 65.02,10.94 R18.2 65.28,11.78 v1(65.28,11.87) 65.98,12.57 ZD3.2 ; C88.2 43.45,18.71 v1(43.81,18.34) ; R61.2 90.82,33.57 ; v1(17.78,14.53) 18.29,15.04 ; C26.1 67.8,16.57 D4.2 ; C110.1 23.7,10.47 v1(24.13,10.47) 24.21,10.39 25.36,10.39 ; C133.1 88.39,19.58 v1(88.39,19.36) ; C28.2 86.23,21.01 v1(86.23,20.5) ; v1(94.94,28.71) 94.94,27.16 94.13,26.34 93.55,26.34 ; D4.2 68.72,15.63 ZD2.2 71.5,12.84 v1(71.5,11.99) 73.78,11.99 75.63,10.15 C21.2 75.63,6.65 v1(75.56,6.59) ; D4.2 69.85,16.57 v1(70.36,16.06) ; D4.2 68.07,15.92 v1(68.07,14.53) ; v1(22.61,6.66) 22.2,7.07 C123.1 ; R28.1 79.48,33.73 v1(78.74,34.47) 77.97,33.7 C85.1 77.48,33.46 v1(77.15,33.46) v1(75.95,33.46) 75.56,33.46 C37.1 ; 74.55,23.81 74.66,23.81 75.48,22.98 75.75,22.98 v1(76.07,22.66) 76.2,22.53 78.49,22.53 ; C124.1 70.61,31.81 v1(70.61,31.68) 68.15,29.22 68.15,24.14 v1(67.56,23.55) ; C78.1 C79.2 93.55,26.34 ; v1(30.61,20) 30.49,20 29.51,19.02 29.51,18.43 30.14,17.8 C111.1 ; R62.1 v1(74.55,29.01) C80.2 ; v1(86.23,20.5) v1(86.23,19.64) ; v1(86.23,20.5) 87.25,20.5 v1(88.39,19.36) ; v1(32.13,7.04) 31.57,7.6 C117.1 ; v1(46.23,5.77) 45.59,6.41 D17.1 v1(44.07,6.41) ; C112.1 C113.1 26.16,13.26 v1(26.29,13.14) 26.54,13.39 C118.2 ; v1(73.42,10.37) 73.42,9.63 C24.1 73.37,8.41 C23.2 ; 78.49,22.53 77.54,21.59 C132.1 77.72,20.7 v1(77.72,20) ; 78.49,22.53 C131.2 ; v1(54.99,15.42) 55.37,15.8 C102.1 54.59,16.07 52.76,14.24 51.61,14.24 ; C22.1 78.23,6.74 v1(78.23,7.17) ; 93.55,26.34 v1(93.09,26.34) ; C27.1 v1(89.77,18.95) 89.54,18.72 89.03,18.72 v1(88.39,19.36) ; R65.1 86.23,19.64 ; v1(80.69,19.64) 81.14,19.64 R64.1 ; C12.1 71.75,22.14 v1(71.75,22.15) ; 92.09,33.57 R60.1 ; v1(15.11,10.22) C129.1 ; Q21.2 22.52,14.57 R97.1 ; R107.2 90.99,37.59 Q19.2 ; v1(72.14,23.55) 72.63,23.55 C6.2 73.42,24.31 v1(73.91,24.31) ; v1(14.61,8.56) C128.2
  vias: v1(1,55) v1(1,53) v1(1,51) v1(1,49) v1(1,47) v1(1,45) v1(1,43) v1(1,41) v1(1,39) v1(1,37) v1(1,35) v1(1,33) v1(1,31) v1(1,29) v1(1,27) v1(1,25) v1(1,23) v1(1,21) v1(1,19) v1(1,17) v1(1,15) v1(1,13) v1(1,11) v1(1,9) v1(1,7) v1(1,5) v1(2.17,57.83) v1(2.17,2.17) v1(5,59) v1(5,1) v1(7,59) v1(7,1) v1(8.74,16.17) v1(8.74,15.55) v1(8.74,14.93) v1(9,59) v1(9,1) v1(9.42,33.47) v1(9.53,29.39) v1(9.91,4.25) v1(10,16.13) v1(10,15.51) v1(10,14.89) v1(11,59) v1(11,1) v1(13,59) v1(13,1) v1(13.46,48.06) v1(14.61,6.66) v1(15,59) v1(15,1) v1(15.75,14.53) v1(15.88,2.98) v1(17,59) v1(17,1) v1(17.57,29.4) v1(17.9,3.27) v1(18.03,19.49) v1(19,59) v1(19,1) v1(20.07,22.15) v1(21,59) v1(21,1) v1(21.84,20.76) v1(22.29,46.92) v1(23,59) v1(23,1) v1(23.12,35.81) v1(23.31,31.48) v1(23.62,40.7) v1(23.64,37.39) v1(23.75,39.43) v1(24.06,24.41) v1(24.13,2.85) v1(24.51,16.06) v1(25,59) v1(24.96,30.31) v1(24.96,24.84) v1(25,1) v1(25.53,22.15) v1(26.29,3.23) v1(27,59) v1(27,1) v1(29,59) v1(29,1) v1(29.59,23.42) v1(29.59,22.15) v1(31,59) v1(31.01,54.58) v1(30.99,3.36) v1(31,1) v1(32.77,23.42) v1(32.77,3.36) v1(33,59) v1(33.02,54.62) v1(33,1) v1(33.83,35.76) v1(33.78,18.34) v1(34.93,39.31) v1(34.93,37.39) v1(35,59) v1(35,1) v1(35.05,21.77) v1(36.19,6.53) v1(37,59) v1(37,1) v1(37.85,13.26) v1(39,59) v1(39,1) v1(39.25,12.67) v1(40.26,4.5) v1(40.51,8.95) v1(41,59) v1(41,1) v1(41.53,22.03) v1(41.68,13.24) v1(42.67,3.74) v1(43,59) v1(43,1) v1(43.31,12.89) v1(43.81,52.76) v1(45,59) v1(45,1) v1(45.34,52.76) v1(46.23,3.74) v1(46.48,33.2) v1(46.48,31.55) v1(47,59) v1(47,1) v1(48.15,25.5) v1(48.15,24.89) v1(48.15,24.27) v1(48.77,24.27) v1(49,59) v1(49,1) v1(49.38,24.27) v1(49.91,8.44) v1(50,24.27) v1(50.55,9.71) v1(50.62,24.27) v1(51,59) v1(51,1) v1(51.23,24.27) v1(51.18,8.69) v1(51.31,3.74) v1(51.85,25.5) v1(51.85,24.89) v1(51.85,24.27) v1(52.07,7.8) v1(52.58,11.36) v1(53,59) v1(53,1) v1(53.09,47.68) v1(53.85,48.57) v1(54,3.74) v1(55,59) v1(55,1) v1(55.5,28.76) v1(55.5,26.85) v1(57,59) v1(57,1) v1(58.04,26.85) v1(58.29,3.74) v1(58.42,24.95) v1(59,59) v1(59,1) v1(59.69,31.3) v1(61,59) v1(60.96,5.64) v1(61,1) v1(63,59) v1(63,1) v1(65,59) v1(65.02,18.47) v1(65,1) v1(65.53,41.45) v1(65.53,36.89) v1(65.69,18.48) v1(66.42,18.47) v1(66.8,6.41) v1(66.93,24.95) v1(67,59) v1(67,1) v1(67.06,54.41) v1(67.06,42.18) v1(67.13,4.82) v1(68.71,53.27) v1(68.71,43.36) v1(69,59) v1(69,1) v1(69.34,16.19) v1(69.47,24.84) v1(70.23,26.85) v1(70.23,25.2) v1(71,59) v1(71,1) v1(72.77,27.74) v1(72.9,2.72) v1(73,59) v1(73,1) v1(73.41,8.69) v1(73.86,3.24) v1(75,59) v1(75,1) v1(76.84,34.09) v1(77,59) v1(77,1) v1(77.34,16.57) v1(77.72,53.33) v1(79,59) v1(79,1) v1(79.34,54.4) v1(80.03,2.81) v1(81,59) v1(81,1) v1(81.57,6.03) v1(82.63,26.08) v1(82.68,25.2) v1(83,59) v1(83,1) v1(83.82,29.65) v1(83.82,28.46) v1(83.82,27.27) v1(83.82,26.08) v1(83.82,25.2) v1(83.97,7.48) v1(85,59) v1(85,1) v1(87,59) v1(87,1) v1(88.85,37.13) v1(89,59) v1(89,1) v1(89.28,42.47) v1(89.41,40.31) v1(89.41,35.87) v1(89.47,37.13) v1(89.81,6.03) v1(89.81,3.74) v1(89.98,48.08) v1(90.08,37.13) v1(90.75,6.98) v1(90.75,2.82) v1(91,59) v1(91,1) v1(91.21,49.46) v1(92.38,48.16) v1(92.71,35.87) v1(93,59) v1(92.98,15.87) v1(93,1) v1(93.22,21.27) v1(93.22,19.36) v1(94.11,16.69) v1(94.14,15.04) v1(94.76,11.45) v1(94.87,35.87) v1(95,59) v1(95,1) v1(96.27,15.93) v1(96.39,18.6) v1(96.67,29.88) v1(97.43,29.04) v1(97.83,57.83) v1(97.83,2.17) v1(99,55) v1(99,53) v1(99,51) v1(99,49) v1(99,47) v1(99,45) v1(99,43) v1(99,41) v1(99,39) v1(99,37) v1(99,35) v1(99,33) v1(99,31) v1(99,29) v1(99,27) v1(99,25) v1(99,23) v1(99,21) v1(99,19) v1(99,17) v1(99,15) v1(99,13) v1(99,11) v1(99,9) v1(99,7) v1(99,5) v2(10.56,34.17) v2(15.56,54.17) v2(15.56,34.17) v2(20.56,54.17) v2(20.56,49.17) v2(20.56,39.17) v2(20.56,34.17) v2(25.56,54.17) v2(25.56,24.17) v2(35.56,54.17) v2(35.56,39.17) v2(35.56,34.17) v2(35.56,29.17) v2(35.69,4.37) v2(40.51,24.31) v2(45.59,24.31) v2(55.5,24.31) v2(59.69,24.31) v2(65.56,54.17) v2(65.56,39.17) v2(65.56,34.17) v2(65.56,29.17) v2(75.56,54.17) v2(85.56,54.17) v2(90.56,54.17) v2(95.56,34.17) v2(95.56,29.17) v2(95.56,9.17)
AVCC: length 104.4
  Top Layer w0.178: R113.2 46.37,21.65 U11.2 ; v1(44.2,16.95) 44.21,16.94 R87.2 ; 63.46,16.96 62.69,16.19 v1(62.61,16.19) 60.83,14.41 60.83,10.32 61.06,10.09 v1(62.74,10.09) ; v1(29.84,14.92) 30.12,14.64 U15.9 ; v1(55.75,21.77) 54.8,20.82 54.2,20.82 53.85,20.47 53.85,17.07 R75.2
  Bottom Layer w0.178: v1(29.84,14.92) 29.84,15.9 C111.2 28.62,17.72 U6.2 ; v1(62.74,10.09) 62.36,9.71 U12.2 ; 55.18,22.47 54.48,21.77 R76.2 ; R77.2 45.22,15.92 v1(44.2,16.95) ; L4.2 63.48,16.19 v1(62.61,16.19) ; 63.88,20.25 66.04,20.25 66.93,19.36 66.93,18.98 67.56,18.34 68.45,18.34 68.71,18.6 68.71,27.61 71.98,30.89 C124.2 73.23,33.68 U5.2 73.23,34.55 73.91,35.23 73.91,35.83 R109.1
  Bottom Layer w0.508: C26.2 63.64,16.35 L4.2 ; C111.2 33.4,16.2 34.15,16.95 v1(44.2,16.95) 46.32,19.08 U4.2 46.32,21.42 R113.2 46.55,21.72 47.43,22.59 55.06,22.59 55.82,21.84 ; v1(55.75,21.77) 55.82,21.84 ; 55.82,21.84 56.33,21.84 56.84,22.34 61.79,22.34 63.88,20.25 63.88,18.72
VCC: length 113.4
  Top Layer w0.178: LED6.2 39.35,14.53 v1(39.88,14.53) ; v1(24.64,13.26) 24.64,11.83 23.45,10.64 22.8,10.64 ; v1(24.38,15.17) 23.88,15.68 23.88,17.22 U15.24 ; v1(55.5,5.39) 55.5,6.15 R96.2 ; 31.3,10.64 v1(30.23,10.64) ; 29.8,9.14 v1(31.37,9.14)
  Top Layer w0.508: CN8.4 48.88,5.66 v1(49.15,5.39)
  Bottom Layer w0.178: v1(30.23,10.64) 30.41,10.46 C116.2 37.71,10.46 C122.2 38.5,13.15 v1(39.88,14.53) ; v1(31.37,9.14) 31.33,9.1 C117.2 ; C113.2 24.01,13.01 22.61,11.61 22.61,9.96 23.48,9.09 ; C113.2 C112.2 24.01,14.8 v1(24.38,15.17) ; C113.2 v1(24.64,13.26) ; C110.2 24.48,9.09 U13.8 U13.7
  Bottom Layer w0.508: v1(49.15,5.39) 49.55,5.79 C125.2 55.1,5.79 v1(55.5,5.39) 58.17,2.72 63.51,2.72 64.5,3.72 64.5,8.46 Q5.3 63.75,9.21 63.75,12.25 66.15,14.64 C25.1 66.15,15.27 L4.1 ; v1(49.15,5.39) 48.39,4.63 43.54,4.63 v1(39.18,8.99) ; v1(49.15,5.39) 49.12,5.42 D17.2 ; C129.2 17.19,8.83 C128.1 18.17,8.56 18.69,9.09 C110.2 23.58,8.35 26.03,5.9 34.53,5.9 38.31,9.67 C122.2 ; C129.2 17.19,11.58 ; C129.2 18.79,10.22 D19.1 ; 17.19,11.58 C130.2 ; 17.19,11.58 15.81,11.58 R112.1 ; C116.2 C117.2
VIN: length 121.9
  Top Layer w0.254: R29.1 v1(22.99,44)
  Top Layer w0.381: R31.2 v1(27.94,32.31)
  Top Layer w0.762: 31.58,33.73 31.82,33.98 C60.2
  信号 w0.254: v1(21.84,22.28) 21.84,26.22 22.35,26.73 22.35,43.36 v1(22.99,44)
  信号 w0.381: v1(27.94,32.31) 28.83,31.42 29.84,31.42 31.03,30.24 31.03,23.06 33.53,20.56 34.53,20.56 v1(34.65,20.68) 57.87,20.68 58.25,20.3 74.62,20.3 78.77,24.44 94.11,24.44 v1(94.62,24.95)
  Bottom Layer w0.254: C83.1 90.35,24.48 U17.32 ; v1(21.84,22.28) 22.33,22.76 U9.3
  Bottom Layer w0.381: C83.1 90.69,24.82 92.03,24.82 ; v1(34.65,20.68) 34.76,20.56 34.82,20.62 U7.3 ; v1(94.62,24.95) 94.62,24.55 94.13,24.06 92.84,24.06 C78.2
  Bottom Layer w0.508: R33.2 40.68,49.54 D12.3
  vias: v1(24.41,45.84) v1(24.41,42.15) v1(25.02,45.84) v1(25.02,42.15) v1(25.64,45.84) v1(25.64,45.23) v1(25.64,44.61) v1(25.64,44) v1(25.64,43.38) v1(25.64,42.77) v1(25.64,42.15) v1(25.62,41.21) v1(25.62,39.3) v1(25.67,37.32) v1(25.67,35.81) v1(25.81,46.92) v1(26.09,34.94) v1(26.09,34.32) v1(26.09,33.71) v1(26.71,34.94) v1(27.32,34.94) v1(27.94,34.94) v1(28.56,34.94) v1(29.17,34.94) v1(29.79,34.94) v1(29.79,34.32) v1(29.79,33.71) v1(30.99,51.08) v1(31.24,35.74) v1(31.34,39.3) v1(31.34,37.43) v1(33.03,51.08) v1(38.63,49.58) v1(39.24,50.81) v1(39.24,48.35) v1(39.86,52.05) v1(39.86,49.58) v1(39.86,47.12) v1(40.47,50.81) v1(40.47,48.35) v1(41.09,52.05) v1(41.09,49.58) v1(41.09,47.12) v1(41.71,50.81) v1(41.71,48.35) v1(42.32,52.05) v1(42.32,49.58) v1(42.32,47.12) v1(42.94,50.81) v1(42.94,48.35)
VINHIMON: length 6.3
  Bottom Layer w0.178: R57.1 91.49,28.5 89.92,28.5 89.15,27.73 U17.27
5: length 23.1
  Top Layer w0.178: R10.2 74.2,14.96 C17.2
  Top Layer w0.508: v1(78.49,11.49) 78.47,11.49 77.75,10.77 75.09,10.77 C17.2 C18.2 C20.2 C19.2 66.08,13.9 L3.2
  Bottom Layer w0.178: Q3.2 78.33,12.61 Q4.2 77.46,13.94 R11.2
  Bottom Layer w0.508: v1(78.49,11.49) 78.57,11.49 Q3.2
6.7: length 24.6
  Top Layer w0.178: Q18.2 78.03,6.02 R103.1 ; R1.2 81.19,7.17 83.18,7.17 84.33,6.03 C4.2
  Top Layer w0.508: C2.2 84.27,2.47 81.44,2.47 81.15,2.76 81.15,4.4 C126.1 78.82,5.54 R103.1
  Bottom Layer w0.178: R2.2 86.6,7.92 v1(86.61,7.93) ; v1(86.61,6.41) 86.76,6.26 Q2.2
  Bottom Layer w0.508: v1(86.61,6.41) 86.81,6.6 Q1.2 86.81,7.74 v1(86.61,7.93)
+24: length 43.7
  Top Layer w0.178: C7.2 75.82,19.05 75.82,21.34 72.68,24.48 72.65,24.48 ; 72.65,24.48 LED2.2 ; 72.65,24.48 74.53,26.36 R20.2
  Bottom Layer w0.508: U17.34 85.17,22.52 C28.1 87.45,22.52 C133.2 89.25,22.14 C27.2 90.57,21.63 91.57,20.63 91.57,18.72 90.68,17.84 v1(75.82,17.84) ; L2.2 70.72,19.11 C12.2 72.39,19.38 R8.2 72.64,16.94 D4.1
  vias: v1(75.06,18.6) v1(75.06,17.84) v1(75.82,18.6)
ADC1_4: length 31.4
  Top Layer w0.178: v1(30.23,18.72) 30.18,18.67 29.52,18.67 29.3,18.45 U15.14 ; v1(57.78,18.34) 57.78,17.56 58.41,16.94
  信号 w0.178: v1(30.23,18.72) 30.4,18.9 56.47,18.9 57.03,18.34 v1(57.78,18.34)
ADC1_5: length 32.7
  Top Layer w0.178: U15.15 28.8,18.7 29.46,19.36 30.99,19.36 v1(32,18.34) ; v1(54.99,8.95) 54.99,8.97 R72.1
  信号 w0.178: v1(32,18.34) 32.9,18.34 34.59,16.65 43.41,16.65 43.71,16.35 45.55,16.35 52.96,8.95 v1(54.99,8.95)
ADC1_6: length 13.5
  Top Layer w0.178: v1(32.77,17.71) 31.58,16.53 28.77,16.53 28.3,16.99 U15.16
  Bottom Layer w0.178: R66.1 40.13,17.71 v1(32.77,17.71)
ADC1_7: length 51.7
  Top Layer w0.178: U15.17 27.8,18.59 v1(29.46,20.25)
  信号 w0.178: v1(66.29,23.3) 65.79,22.79 35.18,22.79 v1(33.91,21.52)
  Bottom Layer w0.178: v1(66.29,23.3) 67.48,24.48 R67.1 ; v1(29.46,20.25) 30.73,21.52 v1(33.91,21.52)
ADC1_8: length 7.2
  Top Layer w0.178: U15.18 27.3,16.99 27.43,16.86 v1(27.43,15.93)
  Bottom Layer w0.178: v1(27.43,15.93) 27.43,16.07 26.79,16.71 23.51,16.71 22.97,16.17 R68.1
ADC1_9: length 21.6
  Top Layer w0.178: R113.1 43.46,20.25 R116.2 42.42,19.23 34.56,19.23 32.91,20.88 29.21,20.88 26.8,18.47 U15.19
BG1: length 6.4
  Bottom Layer w0.254: Q13.2 79.47,36.77 R39.1 82.06,33.02 U17.16
BG2: length 5.3
  Bottom Layer w0.254: U17.18 83.06,35.46 R41.2 82.76,35.76 Q14.2
BOOST1: length 8.6
  Top Layer w0.508: v1(89.28,31.3) 87.25,29.27 D6.3
  Bottom Layer w0.254: U17.24 87.59,29.48 89.41,31.3 C73.2
BOOST2: length 10
  Top Layer w0.508: D7.3 83.82,31.51 v1(83.82,34.47)
  Bottom Layer w0.254: C74.2 84.06,35.43 U17.19
BOOT0: length 13.7
  Top Layer w0.178: v1(29.97,14.03) 30.14,13.86 30.14,12.28 29.68,11.82 29.68,10.41 30.13,9.96 31.62,9.96 32,9.58 32,8.56 31.28,7.84 28.41,7.84 27.8,8.45 27.8,9.14
  Bottom Layer w0.178: v1(29.97,14.03) 29.97,13.51 R95.1
BOOT1: length 2.9
  Top Layer w0.178: v1(26.67,16.06) 26.3,16.43 U15.20
  Bottom Layer w0.178: v1(26.67,16.06) R97.2
BUZZER: length 3.8
  Top Layer w0.178: R114.1 20.53,14.36 20.53,13.43 21.31,12.64 U15.32
CAN+: length 2.9
  Top Layer w0.178: CN5.1 27.88,6.85 v1(27.43,7.29)
  Bottom Layer w0.178: U14.7 28.19,8.1 R93.2 27.43,7.34 v1(27.43,7.29)
CAN-: length 2.9
  Top Layer w0.178: CN5.2 29.59,7.09 v1(29.59,7.29)
  Bottom Layer w0.178: U14.6 28.84,8.1 R93.1 29.59,7.35 v1(29.59,7.29)
CAN_RX: length 7.6
  Top Layer w0.178: 28.3,9.14 28.3,9.79 26.5,11.58 26.5,12.25 26.82,12.57 29.52,12.57 v1(29.59,12.5)
  Bottom Layer w0.178: v1(29.59,12.5) 29.59,12.13 U14.4
CAN_TX: length 4.1
  Top Layer w0.178: 28.8,9.14 28.8,9.79 27.05,11.54 v1(27.05,12.03)
  Bottom Layer w0.178: U14.1 v1(27.05,12.03)
CAP: length 129.2
  Top Layer w0.178: R70.2 63.35,10.83 64.26,11.74 64.26,19.23 68.45,23.42 68.45,25.96 72.9,30.41 v1(73.03,30.41) ; 94.89,42.99 90.81,38.91 v1(90.81,34.47) R54.2 ; 94.89,42.99 CN2.1 ; 94.89,42.99 LED5.2 ; C64.2 76.2,42.59 76.2,38.68 76.6,38.28 77.85,38.28 78.43,38.87 LED7.2
  Top Layer w0.381: R32.1 74.71,48.35 v1(74.68,48.32)
  信号 w0.178: v1(73.03,30.41) 75.06,32.44 78.23,32.44 78.87,31.81 88.14,31.81 v1(90.81,34.47)
  信号 w0.381: v1(74.68,48.32) 73.55,47.19 73.55,46.4 76.2,43.74 90.67,43.74 94.11,40.31 v1(94.11,29.9)
  Bottom Layer w0.178: v1(73.03,30.41) 73.56,30.94 R55.2
  Bottom Layer w0.254: C84.2 89.62,25.23 U17.31
  Bottom Layer w0.381: v1(74.68,48.32) 73.53,47.17 73.53,45.91 69.84,42.22 69.84,41.58 69.9,41.53 U8.3 ; v1(94.11,29.9) 94.11,29.63 92.78,28.3 92.78,27 C79.1 92.01,26.23 C84.2
  vias: v1(75.79,50.19) v1(75.79,46.5) v1(76.4,50.19) v1(76.4,46.5) v1(77.02,50.19) v1(77.02,49.58) v1(77.02,48.96) v1(77.02,48.35) v1(77.72,50.95) v1(77.72,44.63) v1(79.31,50.95) v1(79.34,44.52) v1(81.32,48.28) v1(81.32,46.66) v1(81.31,44.62) v1(82.55,48.28) v1(82.55,46.66) v1(83.23,44.62) v1(83.78,48.28) v1(83.78,46.66) v1(85.01,48.28) v1(85.01,46.66) v1(85.08,44.62) v1(86.24,48.28) v1(86.24,46.66) v1(87,44.62) v1(87.47,48.28) v1(87.47,46.66) v1(88.7,48.28) v1(88.7,46.66)
CAP_RELEASE: length 160.9
  Top Layer w0.178: SW2.2 95.95,39.43 v1(92.2,39.43) ; U15.27 21.44,15.14 v1(21.34,15.04)
  信号 w0.178: v1(92.2,39.43) 91.19,39.43 88.01,42.6 75.44,42.6 71.27,46.77 71.27,52.23 66.04,57.46 13.33,57.46 6.73,50.86 3.56,50.86 2.67,49.97 2.67,34.47 6.86,30.28 6.86,20.38 8,19.23 13.84,19.23 18.07,15 21.3,15 v1(21.34,15.04)
  Bottom Layer w0.178: 91.39,39.49 Q19.1 ; 91.39,39.49 R107.1 ; 91.39,39.49 92.14,39.49 v1(92.2,39.43)
CELL: length 190
  Top Layer w0.178: R53.2 v1(92.2,34.6) ; 61.27,17.95 61.96,17.95 v1(61.98,17.96) ; 12.14,23 v1(15.24,23)
  Top Layer w0.381: R31.1 v1(27.94,30.03)
  Top Layer w0.508: v1(11.34,23) 12.14,23 R45.2
  信号 w0.178: v1(92.2,34.6) 92.84,33.97 92.84,28.75 95.16,26.42 95.16,22.83 94.74,22.41 78.36,22.41 75.1,19.14 61.98,19.14 ; v1(15.24,23) 16.72,21.52 30.99,21.52 33.15,19.36 57,19.36 57.21,19.14 61.98,19.14 ; 61.98,19.14 v1(61.98,17.96)
  信号 w0.381: v1(94.56,23.17) 94.56,23.22 93.98,23.81 78.99,23.81 74.8,19.61 58.04,19.61 57.74,19.91 v1(34.65,19.91) 34.53,20.03 33.31,20.03 30.49,22.84 30.49,30.02 29.62,30.89 28.8,30.89 v1(27.94,30.03)
  Bottom Layer w0.381: v1(34.65,19.91) 34.76,20.03 34.82,19.97 U7.2 ; R51.2 94.49,23.3 94.56,23.22 v1(94.56,23.17)
  vias: v1(8.27,26.08) v1(8.27,24.85) v1(8.27,23.62) v1(8.27,22.38) v1(8.27,21.15) v1(8.27,19.92) v1(9.5,26.08) v1(9.5,19.92) v1(10.11,23.62) v1(10.11,22.38) v1(10.73,26.08) v1(10.73,19.92) v1(11.34,24.23) v1(11.34,21.77) v1(11.96,26.08) v1(11.96,19.92) v1(12.57,23.62) v1(12.57,22.38) v1(13.19,26.08) v1(13.19,19.92) v1(14.42,26.08) v1(14.42,24.85) v1(14.42,23.62) v1(14.42,22.38) v1(14.42,21.15) v1(14.42,19.92)
